# Altium project NMR_System_v2.PrjPcb
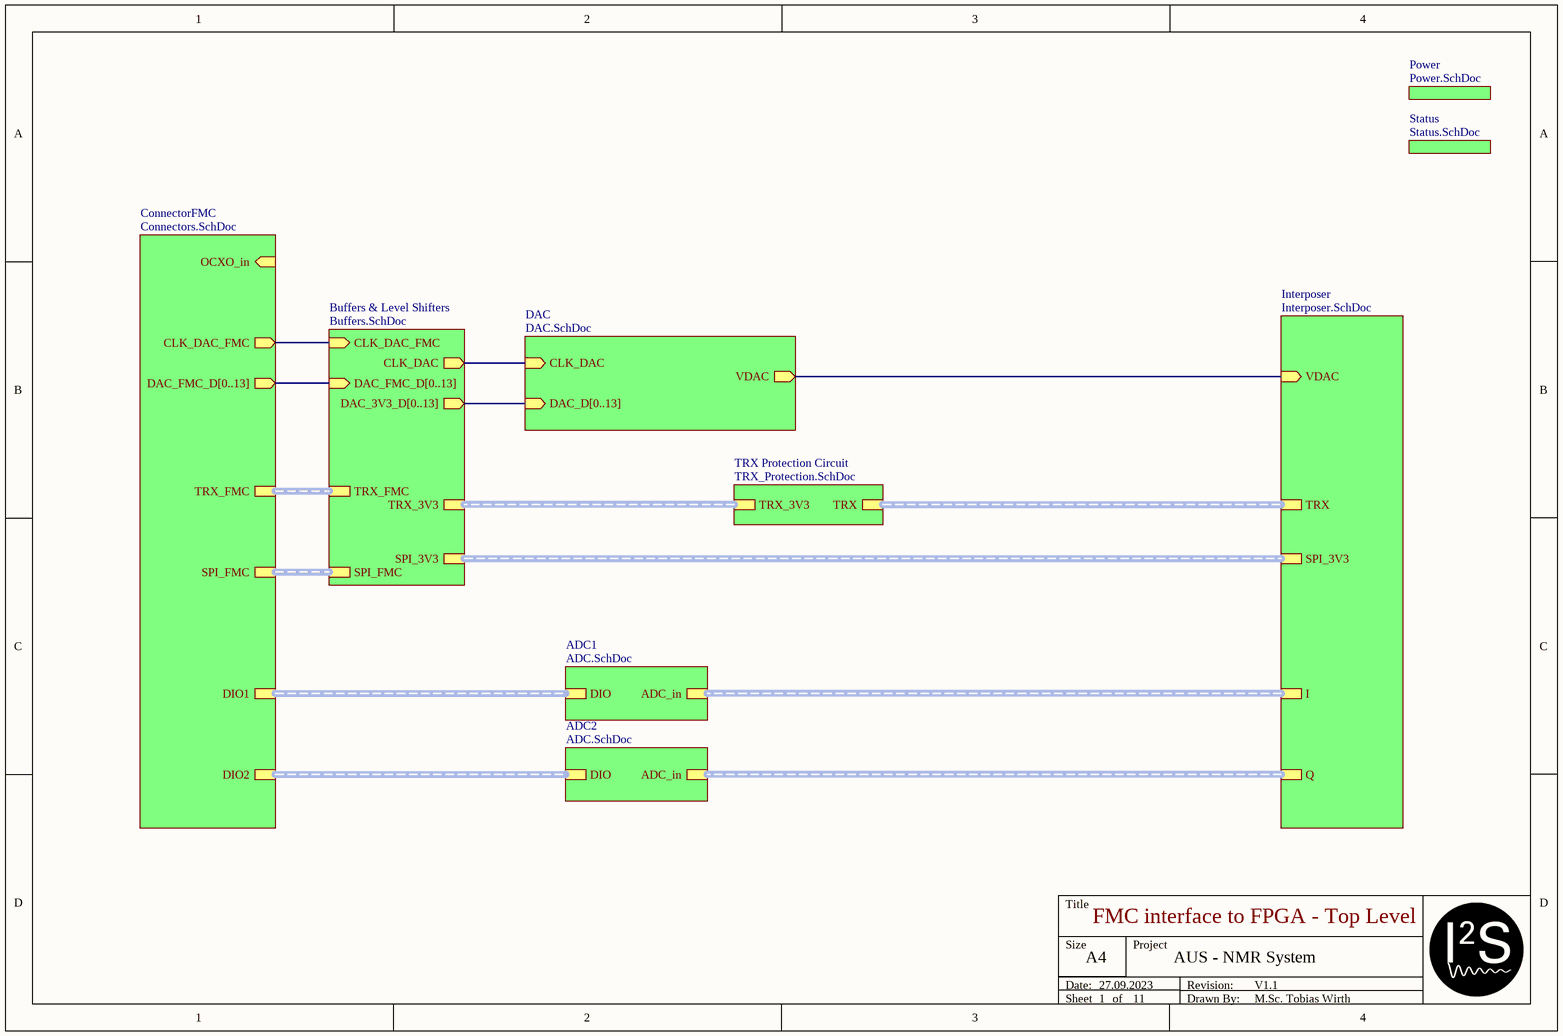
[diagram p0: Top_Level.SchDoc]
CAGE_CODE: ?????; CONTRACT_NUMBER: <CONTRACT NO>; DOC_NO_ASSY_DWG: <ASSY DWG NO>; DOC_NO_BOM: <BOM DOC NO>; DOC_NO_FAB_DWG: <FAB DWG NO>; DOC_NO_SCH_DWG: <SCH DWG NO>; PCB_2_DEC_TOL: +/-.01; PCB_3_DEC_TOL: +/-.010; PCB_ANG_TOL: +/-1/2; PCB_ASSEMBLY_NO: <PCB ASSY NO>; PCB_CHECKER: - -----; PCB_CHECKER_APP_DATE: --/--/----; PCB_DESIGNER: - -----; PCB_DESIGNER_APP_DATE: --/--/----; PCB_DWG_NO: <PCB DWG NO>; PCB_ENGINEER: - -----; PCB_ENGINEER_APP_DATE: --/--/----; PCB_PART_NUMBER: <PCB PN>; PCB_REV: A; SCH_REV: A
9 sheets, 133 parts. Net scope: hierarchical (ports join the sheet entries above them; power ports are global).
Board file: NMR_System_v2.PcbDoc
Sheets:
  Top_Level.SchDoc
    ConnectorFMC = Connectors.SchDoc
    DAC = DAC.SchDoc
    Interposer = Interposer.SchDoc
    ADC2 = ADC.SchDoc
    ADC1 = ADC.SchDoc
    Power = Power.SchDoc
      PDN Backend = Power_BE.SchDoc
    Status = Status.SchDoc
    TRX Protection Circuit = TRX_Protection.SchDoc

## Sheet Top_Level.SchDoc: FMC interface to FPGA - Top Level
size A4; Date: 27.09.2023; ApprovedBy: M.Sc. Tobias Wirth; CheckedBy: M.Sc. Tobias Wirth; Author: M.Sc. Tobias Wirth; CompanyName: University of Stuttgart; DrawnBy: M.Sc. Tobias Wirth; Engineer: M.Sc. Tobias Wirth; Organization: IIS; Address1: Pfaffenwaldring 47; Address2: 70569 Stuttgart; Revision: V1.1; SheetNumber: 1; SheetTotal: 11; ProjectNameAlt: AUS - NMR System; Time: 10:00; ImagePath: N/A; Application_BuildNumber: N/A

### Sub-sheets
ADC1 = ADC.SchDoc: DIO (harness DIO), ADC_in (harness ADC_IN)
ADC2 = ADC.SchDoc: DIO (harness DIO), ADC_in (harness ADC_IN)
Buffers & Level Shifters = Buffers.SchDoc (file not in this document): DAC_FMC_D[0..13] (in), CLK_DAC_FMC (in), TRX_FMC (harness TRX_FMC), SPI_FMC (harness SPI_FMC), CLK_DAC (out), DAC_3V3_D[0..13] (out), TRX_3V3 (harness TRX_3V3), SPI_3V3 (harness SPI_3V3)
ConnectorFMC = Connectors.SchDoc: DIO1 (harness DIO), DIO2 (harness DIO), DAC_FMC_D[0..13] (out), CLK_DAC_FMC (out), OCXO_in (in), TRX_FMC (harness TRX_FMC), SPI_FMC (harness SPI_FMC)
DAC = DAC.SchDoc: VDAC (out), CLK_DAC (in), DAC_D[0..13] (in)
Interposer = Interposer.SchDoc: VDAC (in), TRX (harness TRX), SPI_3V3 (harness SPI_3V3), Q (harness ADC_IN), I (harness ADC_IN)
Power = Power.SchDoc: no entries
Status = Status.SchDoc: no entries
TRX Protection Circuit = TRX_Protection.SchDoc: TRX_3V3 (harness TRX_3V3), TRX (harness TRX)

### Nets
CLK_DAC_FMC: sheet ConnectorFMC/CLK_DAC_FMC, sheet Buffers & Level Shifters/CLK_DAC_FMC
NetR2_2: sheet DAC/VDAC, sheet Interposer/VDAC
NetR4_1: sheet DAC/CLK_DAC, sheet Buffers & Level Shifters/CLK_DAC

### Buses and harness runs
bus sheet Buffers & Level Shifters/DAC_3V3_D[0..13] = sheet DAC/DAC_D[0..13]
bus sheet Buffers & Level Shifters/DAC_FMC_D[0..13] = sheet ConnectorFMC/DAC_FMC_D[0..13]
harness sheet ADC1/ADC_in = sheet Interposer/I
harness sheet ADC1/DIO = sheet ConnectorFMC/DIO1
harness sheet ADC2/ADC_in = sheet Interposer/Q
harness sheet ADC2/DIO = sheet ConnectorFMC/DIO2
harness sheet Buffers & Level Shifters/SPI_3V3 = sheet Interposer/SPI_3V3
harness sheet Buffers & Level Shifters/SPI_FMC = sheet ConnectorFMC/SPI_FMC
harness sheet Buffers & Level Shifters/TRX_3V3 = sheet TRX Protection Circuit/TRX_3V3
harness sheet Buffers & Level Shifters/TRX_FMC = sheet ConnectorFMC/TRX_FMC
harness sheet Interposer/TRX = sheet TRX Protection Circuit/TRX

### Notes on the sheet
- Title
- Size
- Date:
- Sheet
- A4
- of
- Project
- Drawn By:
- Revision:

## Sheet Connectors.SchDoc: Connectors
size A4; Date: 27.09.2023; ApprovedBy: M.Sc. Tobias Wirth; CheckedBy: M.Sc. Tobias Wirth; Author: M.Sc. Tobias Wirth; CompanyName: University of Stuttgart; DrawnBy: M.Sc. Tobias Wirth; Engineer: M.Sc. Tobias Wirth; Organization: IIS; Address1: Pfaffenwaldring 47; Address2: 70569 Stuttgart; Revision: V1.4; SheetNumber: 2; SheetTotal: 17; ProjectNameAlt: AUS - NMR System; Time: 14:10; ImagePath: N/A; Application_BuildNumber: N/A
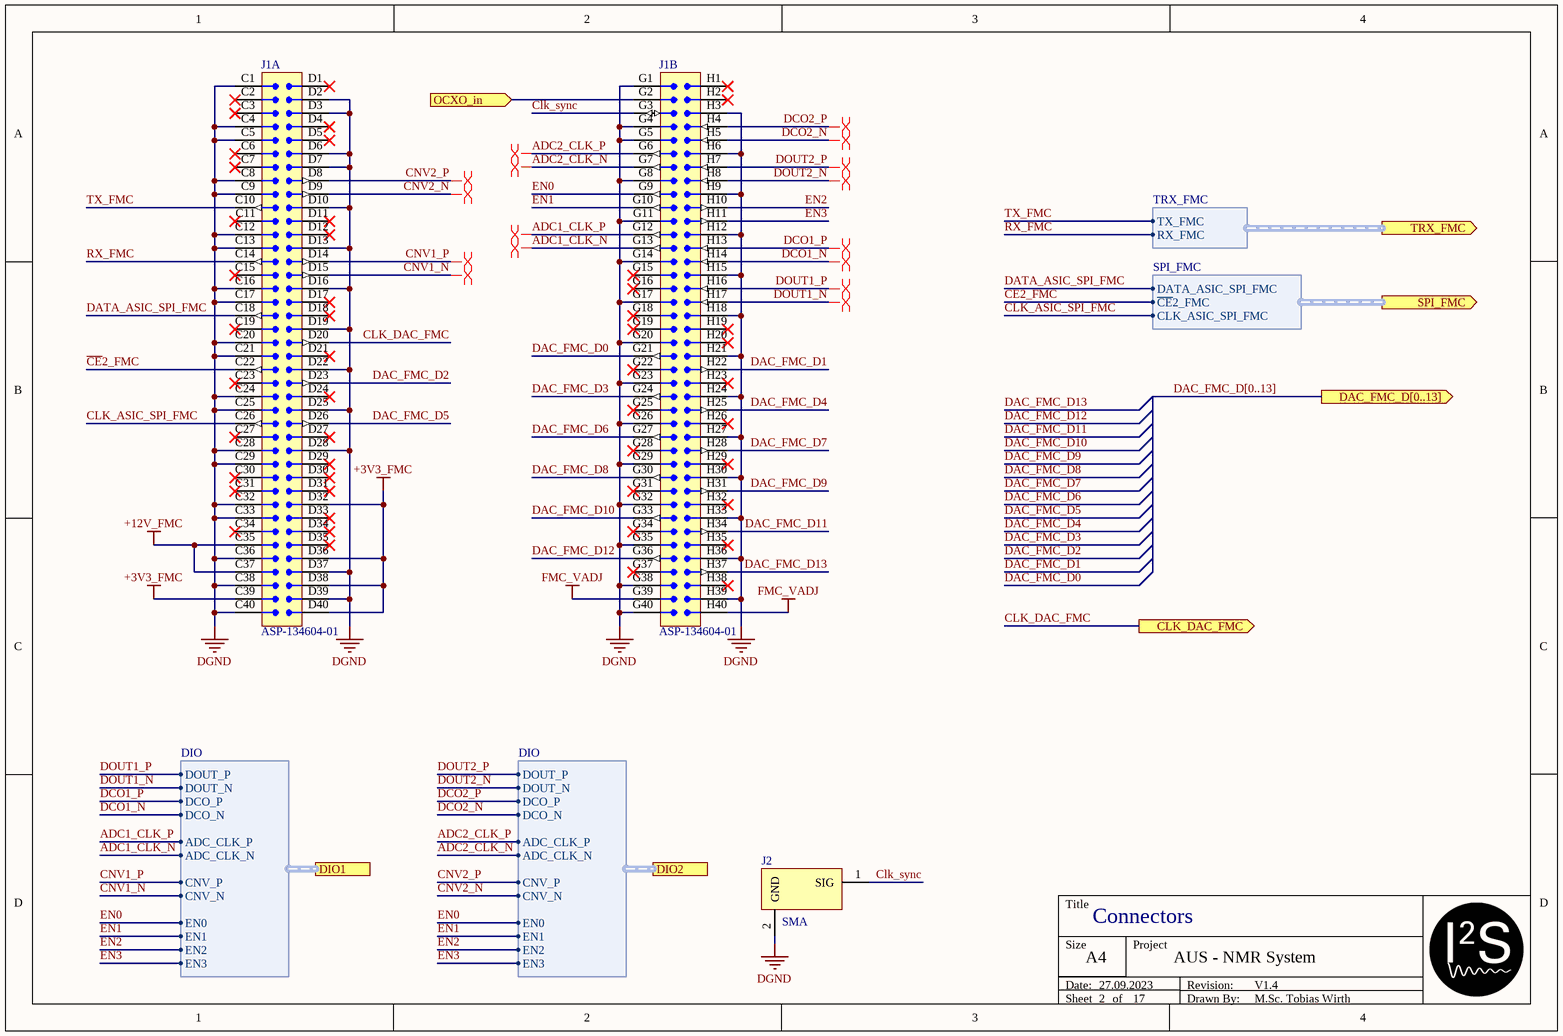
[diagram p1: Connectors.SchDoc]

### Parts
J1  ASP-134604-01  [ASP13460401]  (parts A,B of 2)
J2  SMA  [SMA]

### Ports
CLK_DAC_FMC (out), DAC_FMC_D[0..13] (out), DIO1 (harness DIO), DIO2 (harness DIO), OCXO_in (in), SPI_FMC (out, harness SPI_FMC), TRX_FMC (out, harness TRX_FMC)

### Harnesses
DIO: ADC_CLK_N, ADC_CLK_P, CNV_N, CNV_P, DCO_N, DCO_P, DOUT_N, DOUT_P, EN0, EN1, EN2, EN3
SPI_FMC: DATA_ASIC_SPI_FMC, ~{CE}2_FMC, CLK_ASIC_SPI_FMC
TRX_FMC: TX_FMC, RX_FMC

### Nets
+3V3_FMC: J1.C39 J1.D32 J1.D36 J1.D38 J1.D40
+12V_FMC: J1.C35 J1.C37
DGND: J1.C1 J1.C4 J1.C5 J1.C8 J1.C9 J1.C12 J1.C13 J1.C16 J1.C17 J1.C20 J1.C21 J1.C24 J1.C25 J1.C28 J1.C29 J1.C32 J1.C33 J1.C36 J1.C38 J1.C40 J1.D2 J1.D3 J1.D6 J1.D7 J1.D10 J1.D13 J1.D16 J1.D19 J1.D22 J1.D25 J1.D28 J1.D37 J1.D39 J1.G1 J1.G4 J1.G5 J1.G8 J1.G11 J1.G14 J1.G17 J1.G20 J1.G23 J1.G26 J1.G29 J1.G32 J1.G35 J1.G38 J1.G40 J1.H3 J1.H6 J1.H9 J1.H12 J1.H15 J1.H18 J1.H21 J1.H24 J1.H27 J1.H30 J1.H33 J1.H36 J1.H39 J2.2(GND)
FMC_VADJ: J1.G39 J1.H40
ADC1_CLK_N: J1.G13 ; port DIO1.ADC_CLK_N
ADC1_CLK_P: J1.G12 ; port DIO1.ADC_CLK_P
ADC2_CLK_N: J1.G7 ; port DIO2.ADC_CLK_N
ADC2_CLK_P: J1.G6 ; port DIO2.ADC_CLK_P
~{CE}2_FMC: J1.C22 ; port SPI_FMC.~{CE}2_FMC
CLK_ASIC_SPI_FMC: J1.C26 ; port SPI_FMC.CLK_ASIC_SPI_FMC
CLK_DAC_FMC: J1.D20 ; port CLK_DAC_FMC
Clk_sync: J1.G3 J2.1(SIG)
CNV1_N: J1.D15 ; port DIO1.CNV_N
CNV1_P: J1.D14 ; port DIO1.CNV_P
CNV2_N: J1.D9 ; port DIO2.CNV_N
CNV2_P: J1.D8 ; port DIO2.CNV_P
DAC_FMC_D0: J1.G21
DAC_FMC_D1: J1.H22
DAC_FMC_D2: J1.D23
DAC_FMC_D3: J1.G24
DAC_FMC_D4: J1.H25
DAC_FMC_D5: J1.D26
DAC_FMC_D6: J1.G27
DAC_FMC_D7: J1.H28
DAC_FMC_D8: J1.G30
DAC_FMC_D9: J1.H31
DAC_FMC_D10: J1.G33
DAC_FMC_D11: J1.H34
DAC_FMC_D12: J1.G36
DAC_FMC_D13: J1.H37
DATA_ASIC_SPI_FMC: J1.C18 ; port SPI_FMC.DATA_ASIC_SPI_FMC
DCO1_N: J1.H14 ; port DIO1.DCO_N
DCO1_P: J1.H13 ; port DIO1.DCO_P
DCO2_N: J1.H5 ; port DIO2.DCO_N
DCO2_P: J1.H4 ; port DIO2.DCO_P
DOUT1_N: J1.H17 ; port DIO1.DOUT_N
DOUT1_P: J1.H16 ; port DIO1.DOUT_P
DOUT2_N: J1.H8 ; port DIO2.DOUT_N
DOUT2_P: J1.H7 ; port DIO2.DOUT_P
EN0: J1.G9 ; port DIO1.EN0, port DIO2.EN0
EN1: J1.G10 ; port DIO1.EN1, port DIO2.EN1
EN2: J1.H10 ; port DIO1.EN2, port DIO2.EN2
EN3: J1.H11 ; port DIO1.EN3, port DIO2.EN3
RX_FMC: J1.C14 ; port TRX_FMC.RX_FMC
TX_FMC: J1.C10 ; port TRX_FMC.TX_FMC
NetJ1_G2: J1.G2 ; port OCXO_in

Not connected (* = marked no-connect by the designer): J1 C2* C3* C6* C7* C11* C15* C19* C23* C27* C30* C31* C34* D1* D4* D5* D11* D12* D17* D18* D21* D24* D27* D29* D30* D31* D33* D34* D35* G15* G16* G18* G19* G22* G25* G28* G31* G34* G37* H1* H2* H19* H20* H23* H26* H29* H32* H35* H38*

### Buses and harness runs
bus DAC_FMC_D[0..13] = port DAC_FMC_D[0..13]

### Layout directives
differential pair: ADC1_CLK_N, ADC1_CLK_P, ADC2_CLK_N, ADC2_CLK_P, CNV1_N, CNV1_P, CNV2_N, CNV2_P, DCO1_N, DCO1_P, DCO2_N, DCO2_P, DOUT1_N, DOUT1_P, DOUT2_N, DOUT2_P

### Notes on the sheet
- Title
- Size
- Date:
- Sheet
- A4
- of
- Project
- Drawn By:
- Revision:

### Library data of the parts
J1 = ASP-134604-01: Board to Board & Mezzanine Connectors "ASP"; Supplier 1: Arrow Electronics; Supplier Part Number 1: ASP-134604-01

## Sheet DAC.SchDoc: Digital to Analog Converter
size A4; Date: 27.09.2023; ApprovedBy: M.Sc. Tobias Wirth; CheckedBy: M.Sc. Tobias Wirth; Author: M.Sc. Tobias Wirth; CompanyName: University of Stuttgart; DrawnBy: M.Sc. Tobias Wirth; Engineer: M.Sc. Tobias Wirth; Organization: IIS; Address1: Pfaffenwaldring 47; Address2: 70569 Stuttgart; Revision: V1.5; SheetNumber: 4; SheetTotal: 11; ProjectNameAlt: AUS - NMR System; Time: 15:20; ImagePath: N/A; Application_BuildNumber: N/A
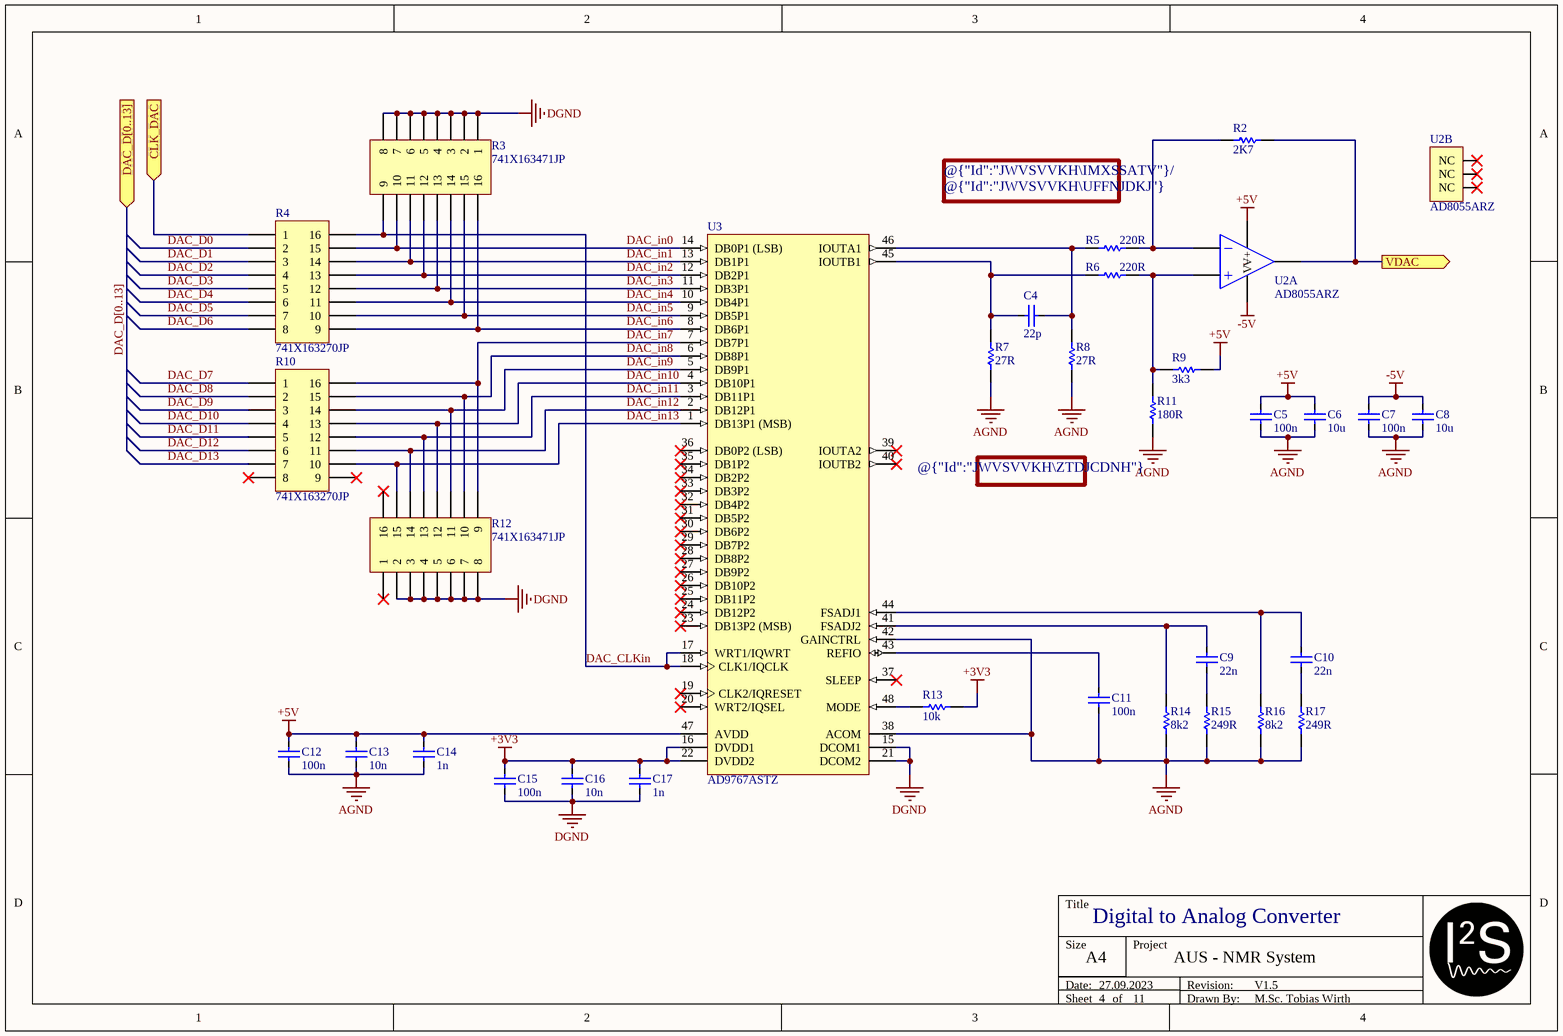
[diagram p2: DAC.SchDoc]

### Parts
C4  22p  [CAP_0402]
C5  100n  [CAP_0402]
C6  10u  [CAP_0603]
C7  100n  [CAP_0402]
C8  10u  [CAP_0603]
C9  22n  [CAP_0402]
C10  22n  [CAP_0402]
C11  100n  [CAP_0402]
C12  100n  [CAP_0402]
C13  10n  [CAP_0402]
C14  1n  [CAP_0402]
C15  100n  [CAP_0402]
C16  10n  [CAP_0402]
C17  1n  [CAP_0402]
R2  2K7  [RES_0402]
R3  741X163471JP  [741X163]
R4  741X163270JP  [741X163]
R5  220R  [RES_0402]
R6  220R  [RES_0402]
R7  27R  [RES_0402]
R8  27R  [RES_0402]
R9  3k3  [RES_0402]
R10  741X163270JP  [741X163]
R11  180R  [RES_0402]
R12  741X163471JP  [741X163]
R13  10k  [RES_0402]
R14  8k2  [RES_0402]
R15  249R  [RES_0402]
R16  8k2  [RES_0402]
R17  249R  [RES_0402]
U2  AD8055ARZ  [SOIC127P600X175-8N]  (parts A,B of 2)
U3  AD9767ASTZ  [TQFP-48_L]

### Ports
CLK_DAC (in), DAC_D[0..13] (in), VDAC (out)

### Nets
+3V3: C15.1 C16.1 C17.1 R13.1 U3.16(DVDD1) U3.22(DVDD2)
+5V: C5.1 C6.1 C12.1 C13.1 C14.1 R9.1 U2.7(V+) U3.47(AVDD)
-5V: C7.1 C8.1 U2.4(V−)
AGND: C5.2 C6.2 C7.2 C8.2 C11.2 C12.2 C13.2 C14.2 R7.1 R8.1 R11.1 R14.1 R15.1 R16.1 R17.1 U3.38(ACOM) U3.42(GAINCTRL)
DGND: C15.2 C16.2 C17.2 R3.1 R3.2 R3.3 R3.4 R3.5 R3.6 R3.7 R3.8 R12.2 R12.3 R12.4 R12.5 R12.6 R12.7 R12.8 U3.15(DCOM1) U3.21(DCOM2)
DAC_CLKin: R3.9 R4.16 U3.17(WRT1/IQWRT) U3.18(CLK1/IQCLK)
DAC_D0: R4.2
DAC_D1: R4.3
DAC_D2: R4.4
DAC_D3: R4.5
DAC_D4: R4.6
DAC_D5: R4.7
DAC_D6: R4.8
DAC_D7: R10.1
DAC_D8: R10.2
DAC_D9: R10.3
DAC_D10: R10.4
DAC_D11: R10.5
DAC_D12: R10.6
DAC_D13: R10.7
DAC_in0: R3.10 R4.15 U3.14(DB0P1_(LSB))
DAC_in1: R3.11 R4.14 U3.13(DB1P1)
DAC_in2: R3.12 R4.13 U3.12(DB2P1)
DAC_in3: R3.13 R4.12 U3.11(DB3P1)
DAC_in4: R3.14 R4.11 U3.10(DB4P1)
DAC_in5: R3.15 R4.10 U3.9(DB5P1)
DAC_in6: R3.16 R4.9 U3.8(DB6P1)
DAC_in7: R10.16 R12.9 U3.7(DB7P1)
DAC_in8: R10.15 R12.10 U3.6(DB8P1)
DAC_in9: R10.14 R12.11 U3.5(DB9P1)
DAC_in10: R10.13 R12.12 U3.4(DB10P1)
DAC_in11: R10.12 R12.13 U3.3(DB11P1)
DAC_in12: R10.11 R12.14 U3.2(DB12P1)
DAC_in13: R10.10 R12.15 U3.1(DB13P1_(MSB))
NetC4_1: C4.1 R5.2 R8.2 U3.46(IOUTA1)
NetC4_2: C4.2 R6.2 R7.2 U3.45(IOUTB1)
NetC9_1: C9.1 R14.2 U3.41(FSADJ2)
NetC9_2: C9.2 R15.2
NetC10_1: C10.1 R16.2 U3.44(FSADJ1)
NetC10_2: C10.2 R17.2
NetC11_1: C11.1 U3.43(REFIO)
NetR2_1: R2.1 R5.1 U2.2(−)
NetR2_2: R2.2 U2.6 ; port VDAC
NetR4_1: R4.1 ; port CLK_DAC
NetR6_1: R6.1 R9.2 R11.2 U2.3(+)
NetR13_2: R13.2 U3.48(MODE)

Not connected (* = marked no-connect by the designer): R10 8* 9*; R12 1* 16*; U2 1(NC)* 5(NC)* 8(NC)*; U3 19(CLK2/IQRESET)* 20(WRT2/IQSEL)* 23(DB13P2_(MSB))* 24(DB12P2)* 25(DB11P2)* 26(DB10P2)* 27(DB9P2)* 28(DB8P2)* 29(DB7P2)* 30(DB6P2)* 31(DB5P2)* 32(DB4P2)* 33(DB3P2)* 34(DB2P2)* 35(DB1P2)* 36(DB0P2_(LSB))* 37(SLEEP)* 39(IOUTA2)* 40(IOUTB2)*

### Buses and harness runs
bus DAC_D[0..13] = port DAC_D[0..13]

### Notes on the sheet
- @{"Id":"JWVSVVKH\IMXSSATV"}/ @{"Id":"JWVSVVKH\UFFNJDKJ"} sets the gain
  @{"Id":"JWVSVVKH\NLDPBRXG"}/ @{"Id":"JWVSVVKH\IJMLKELA"} sets the DC lvl
- @{"Id":"JWVSVVKH\ZTDJCDNH"} ist optional
- Title
- Size
- Date:
- Sheet
- A4
- of
- Project
- Drawn By:
- Revision:

### Library data of the parts
C4-C17 = Cap: Supplier: *; Part Number: *
  C4: Value: 22p
  C5 C7 C11 C12 C15: Value: 100n
  C6 C8: Value: 10u
  C9 C10: Value: 22n
  C13 C16: Value: 10n
  C14 C17: Value: 1n
R2 R5-R9 R11 R13-R17 = Res: Part Number: *; Supplier: *
  R2: Value: 2K7
  R5 R6: Value: 220R
  R7 R8: Value: 27R
  R9: Value: 3k3
  R11: Value: 180R
  R13: Value: 10k
  R14 R16: Value: 8k2
  R15 R17: Value: 249R
R3 R4 R10 R12 = 741X163: Isolated 8 Resistor Network/Array, Convex, Long Side Terminals; Supplier 1: Mouser
  R3 R12: Supplier Part Number 1: 774-741X163471JP
  R4 R10: Supplier Part Number 1: 774-741X163270JP
U2 = AD8055: 300 MHz Voltage Feedback Amplifier; Supplier 1: Mouser; Supplier Part Number 1: 584-AD8055ARZ
U3 = AD9767: Dual 14-Bit TxDAC+, 125 Msps, -40 to +85 degC, ST-48, Pb-Free, Tray; Manufacturer: Analog Devices; Single Supply: Yes; Resolution (Bits): 14; Settling Time: 35ns; Max V+: 5.5V; Op Pwr Diss: 450mW; # DAC Outputs: 2; ComponentLink2Description: Datasheet; ComponentLink2URL: http://www.analog.com/static/imported-files/data_sheets/AD9763_9765_9767.pdf; ComponentLink4URL: http://www.analog.com/en/digital-to-analog-converters/da-converters/ad9767/products/product.html; ComponentLink4Description: Product URL; Packing: Tray; DatasheetVersion: Rev.G; PackageReference: ST-48; RoHS: Y; Generic Part Number: AD9767; ComponentLink3URL: http://www.analog.com/static/imported-files/packages/PKG_PDF/LQFP%28ST%29/ST_48.pdf; ComponentLink1URL: http://www.analog.com/en/index.html; RevisionNote: Component URL fixed; PartNumber: AD9767ASTZ; Mounting Technology: Surface Mount; PackageVersion: revA; ComponentLink1Description: Manufacturer URL; PackageDescription: 48-Pin Thin Quad Flat Pack 0.5 mm Pitch; ComponentLink3Description: Package Specification; Supplier 1: Digi-Key; Supplier Part Number 1: 505-AD9767ASTZ-ND

## Sheet Interposer.SchDoc: Connectors - Frontend
size A4; Date: 28.09.2023; ApprovedBy: M.Sc. Tobias Wirth; CheckedBy: M.Sc. Tobias Wirth; Author: M.Sc. Tobias Wirth; CompanyName: University of Stuttgart; DrawnBy: M.Sc. Tobias Wirth; Engineer: M.Sc. Tobias Wirth; Organization: IIS; Address1: Pfaffenwaldring 47; Address2: 70569 Stuttgart; Revision: V1.2; SheetNumber: 5; SheetTotal: 11; ProjectNameAlt: AUS - NMR System; Time: 13:40; ImagePath: N/A; Application_BuildNumber: N/A
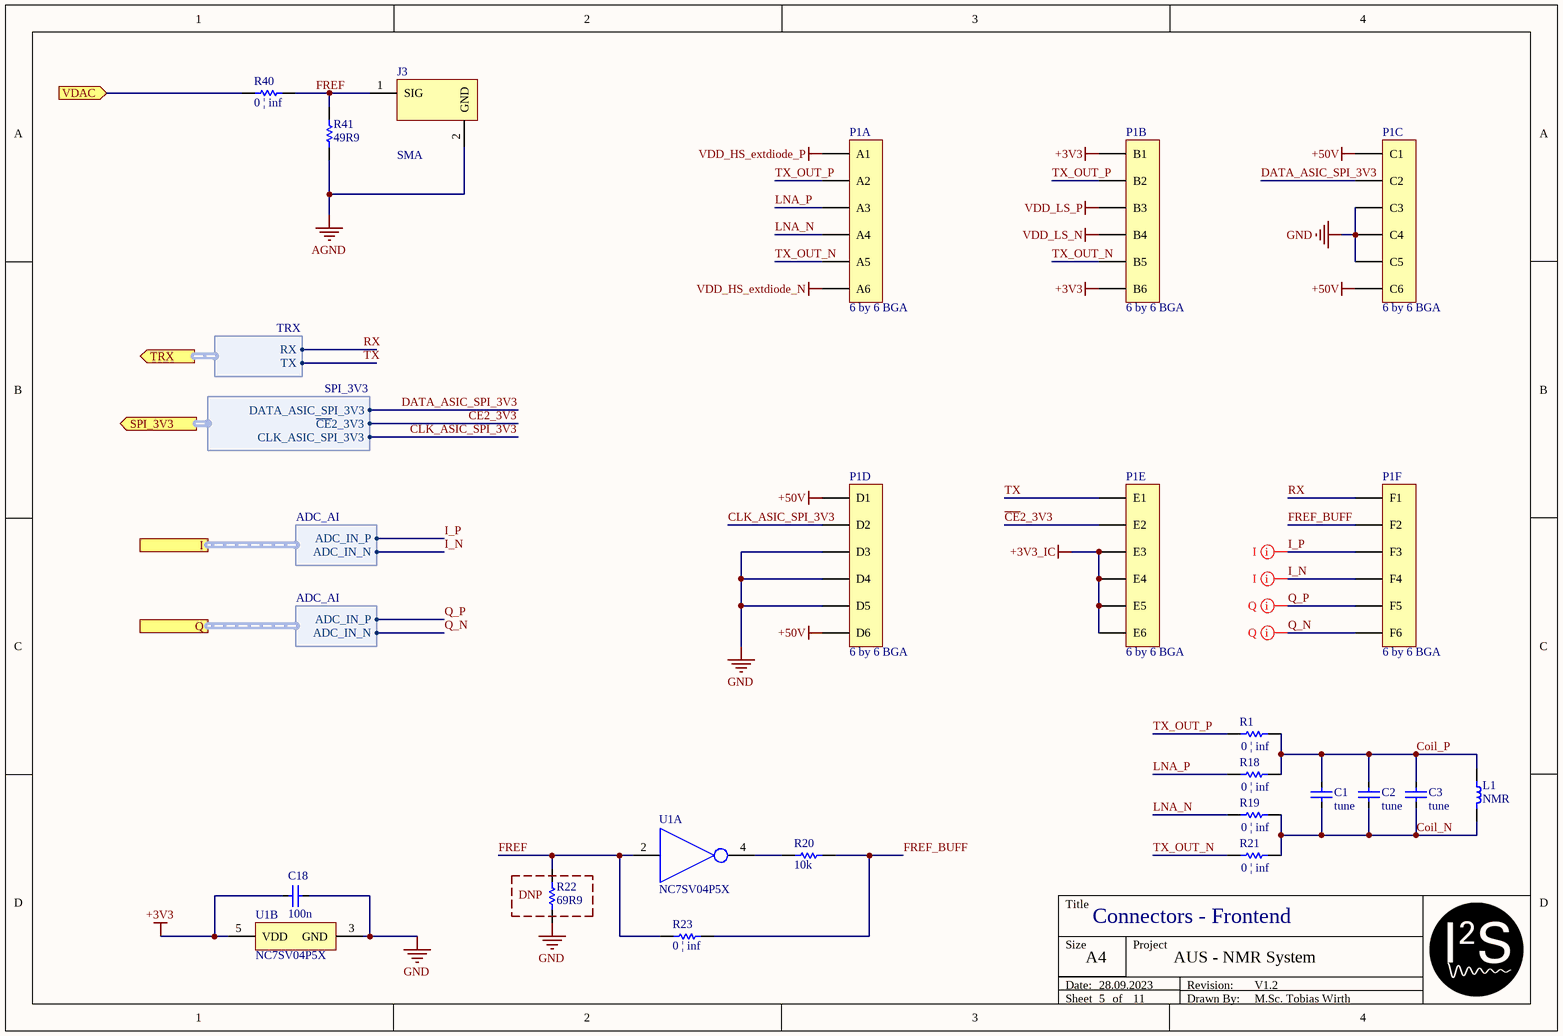
[diagram p3: Interposer.SchDoc]

### Parts
C1  tune  [CAP_1206]
C2  tune  [CAP_0805]
C3  tune  [CAP_0603]
C18  100n  [CAP_0402]
J3  SMA  [SMA]
L1  NMR  [NMR-Coil-Pads]
P1  6 by 6 BGA  [BGA36C230P6X6_1500X1500X190 - Interposer]  (parts A,B,C,D,E,F of 6)
R1  0 | inf  [RES_0402]
R18  0 | inf  [RES_0402]
R19  0 | inf  [RES_0402]
R20  10k  [RES_0402]
R21  0 | inf  [RES_0402]
R22  69R9  [RES_0603]
R23  value 0 | inf  [RES_0402]
R40  0 | inf  [RES_0402]
R41  49R9  [RES_0402]
U1  NC7SV04P5X  [SOT23-65P210X110-5N]  (parts A,B of 2)

### Blocks framed on the sheet
DNP: R22

### Ports
I (harness ADC_AI), Q (harness ADC_AI), SPI_3V3 (out, harness SPI_3V3), TRX (out, harness TRX), VDAC (in)

### Harnesses
TRX: TX, RX
SPI_3V3: DATA_ASIC_SPI_3V3, ~{CE}2_3V3, CLK_ASIC_SPI_3V3
ADC_AI: ADC_IN_P, ADC_IN_N

### Nets
+3V3: C18.1 P1.B1 P1.B6 U1.5(VDD)
+3V3_IC: P1.E3 P1.E4 P1.E5 P1.E6
+50V: P1.C1 P1.C6 P1.D1 P1.D6
AGND: J3.2(GND) R41.1
GND: C18.2 P1.C3 P1.C4 P1.C5 P1.D3 P1.D4 P1.D5 R22.1 U1.3(GND)
VDD_HS_extdiode_N: P1.A6
VDD_HS_extdiode_P: P1.A1
VDD_LS_N: P1.B4
VDD_LS_P: P1.B3
~{CE}2_3V3: P1.E2 ; port SPI_3V3.~{CE}2_3V3
CLK_ASIC_SPI_3V3: P1.D2 ; port SPI_3V3.CLK_ASIC_SPI_3V3
Coil_N: C1.2 C2.2 C3.2 L1.2 R19.1 R21.1
Coil_P: C1.1 C2.1 C3.1 L1.1 R1.1 R18.1
DATA_ASIC_SPI_3V3: P1.C2 ; port SPI_3V3.DATA_ASIC_SPI_3V3
FREF: J3.1(SIG) R22.2 R23.2 R40.2 R41.2 U1.2
FREF_BUFF: P1.F2 R20.2 R23.1
I_N: P1.F4 ; port I.ADC_IN_N  [project net ADC_IN_N]
I_P: P1.F3 ; port I.ADC_IN_P  [project net ADC_IN_P]
LNA_N: P1.A4 R19.2
LNA_P: P1.A3 R18.2
Q_N: P1.F6 ; port Q.ADC_IN_N  [project net ADC_IN_N]
Q_P: P1.F5 ; port Q.ADC_IN_P  [project net ADC_IN_P]
RX: P1.F1 ; port TRX.RX
TX: P1.E1 ; port TRX.TX
TX_OUT_N: P1.A5 P1.B5 R21.2
TX_OUT_P: P1.A2 P1.B2 R1.2
NetR2_2: R40.1 ; port VDAC
NetR20_1: R20.1 U1.4

### Layout directives
differential pair; differential pair class IQ; net class IQ: ADC_IN_N, ADC_IN_P

### Notes on the sheet
- Title
- Size
- Date:
- Sheet
- A4
- of
- Project
- Drawn By:
- Revision:

### Library data of the parts
C1-C3 C18 = Cap: Supplier: *; Part Number: *
  C1-C3: Value: tune
  C18: Value: 100n
L1 = Ind: Part Number: *; Supplier: *; Value: NMR
P1 = BGA_6x6
R1 R18-R23 R40 R41 = Res: Part Number: *; Supplier: *
  R1 R18 R19 R21 R40: Value: 0 | inf
  R20: Value: 10k
  R22: Value: 69R9
  R41: Value: 49R9

## Sheet ADC.SchDoc: Analog to Digital Converter
size A4; Date: 06.10.2023; ApprovedBy: M.Sc. Tobias Wirth; CheckedBy: M.Sc. Tobias Wirth; Author: M.Sc. Tobias Wirth; CompanyName: University of Stuttgart; DrawnBy: M.Sc. Tobias Wirth; Engineer: M.Sc. Tobias Wirth; Organization: IIS; Address1: Pfaffenwaldring 47; Address2: 70569 Stuttgart; Revision: V1.1; SheetNumber: 6; SheetTotal: 11; ProjectNameAlt: AUS - NMR System; Time: 16:00; ImagePath: N/A; Application_BuildNumber: N/A
Used 2 times, as channels ADC2, ADC1. Parts and nets are listed once, with the designators drawn on the sheet.
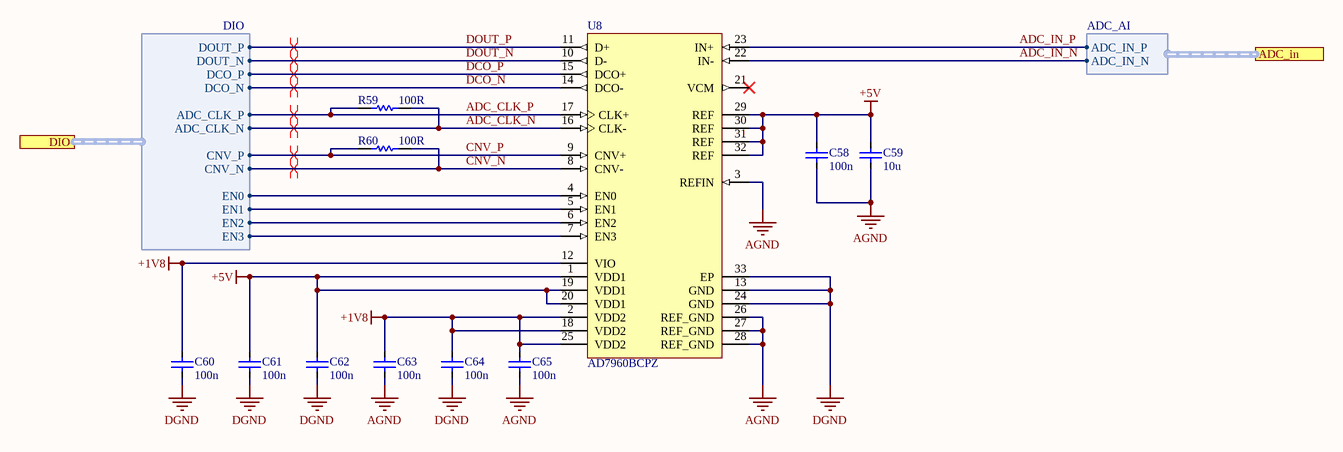
[diagram p4: ADC.SchDoc]

### Parts
C58  100n  [CAP_0402]
C59  10u  [CAP_0603]
C60  100n  [CAP_0402]
C61  100n  [CAP_0402]
C62  100n  [CAP_0402]
C63  100n  [CAP_0402]
C64  100n  [CAP_0402]
C65  100n  [CAP_0402]
R59  100R  [RES_0402]
R60  100R  [RES_0402]
U8  AD7960BCPZ  [ADI-CP-32-7_M]

### Ports
ADC_in (harness ADC_AI), DIO (harness DIO)

### Harnesses
DIO: ADC_CLK_N, ADC_CLK_P, CNV_N, CNV_P, DCO_N, DCO_P, DOUT_N, DOUT_P, EN0, EN1, EN2, EN3
ADC_AI: ADC_IN_P, ADC_IN_N

### Nets
+1V8: C60.1 C63.1 C64.1 C65.1 U8.2(VDD2) U8.12(VIO) U8.18(VDD2) U8.25(VDD2)
+5V: C58.1 C59.1 C61.1 C62.1 U8.1(VDD1) U8.19(VDD1) U8.20(VDD1) U8.29(REF) U8.30(REF) U8.31(REF) U8.32(REF)
AGND: C58.2 C59.2 C63.2 C65.2 U8.3(REFIN) U8.26(REF_GND) U8.27(REF_GND) U8.28(REF_GND)
DGND: C60.2 C61.2 C62.2 C64.2 U8.13(GND) U8.24(GND) U8.33(EP)
ADC_CLK_N: R59.2 U8.16(CLK-) ; port DIO.ADC_CLK_N
ADC_CLK_P: R59.1 U8.17(CLK+) ; port DIO.ADC_CLK_P
ADC_IN_N: U8.22(IN-) ; port ADC_in.ADC_IN_N
ADC_IN_P: U8.23(IN+) ; port ADC_in.ADC_IN_P
CNV_N: R60.2 U8.8(CNV-) ; port DIO.CNV_N
CNV_P: R60.1 U8.9(CNV+) ; port DIO.CNV_P
DCO_N: U8.14(DCO-) ; port DIO.DCO_N
DCO_P: U8.15(DCO+) ; port DIO.DCO_P
DOUT_N: U8.10(D-) ; port DIO.DOUT_N
DOUT_P: U8.11(D+) ; port DIO.DOUT_P
NetU8_4: U8.4(EN0) ; port DIO.EN0
NetU8_5: U8.5(EN1) ; port DIO.EN1
NetU8_6: U8.6(EN2) ; port DIO.EN2
NetU8_7: U8.7(EN3) ; port DIO.EN3

Not connected (* = marked no-connect by the designer): U8 21(VCM)*

### Channels
ADC2: designators end in _ADC2
ADC1: designators end in _ADC1

### Layout directives
differential pair; net class ADC_OUT: ADC2_CLK_N, ADC2_CLK_P, CNV2_N, CNV2_P, DCO2_N, DCO2_P, DOUT2_N, DOUT2_P

### Notes on the sheet
- Title
- Size
- Date:
- Sheet
- A4
- of
- Project
- Drawn By:
- Revision:

### Library data of the parts
C58-C65 = Cap: Supplier: *; Part Number: *
  C58 C60-C65: Value: 100n
  C59: Value: 10u
R59 R60 = Res: Part Number: *; Supplier: *; Value: 100R
U8 = AD7960: Single 18-Bit PulSAR Differential Analog-to-Digital Converter with Serial LVDS Interface, 5 MSPS, -40 to 85 degC, CP-32-7, RoHS, Tray; Manufacturer: Analog Devices; Full Power BW: 28 MHz; # of Channels: 1; Throughput Rate: 5 MSPS; Dynamic Range: 100 dB; Resolution: 18 Bits; ComponentLink1Description: Manufacturer URL; ComponentLink3Description: Package Specification; PartNumber: AD7960BCPZ; ComponentLink1URL: http://www.analog.com/en/index.html; ComponentLink2URL: http://www.analog.com/static/imported-files/data_sheets/AD7960.pdf; ComponentLink3URL: http://www.analog.com/static/imported-files/packages/CP_32_7.pdf; RoHS: TRUE; DatasheetVersion: Rev. A; ADC_Sample_Rate: 5 MSPS; Mounting Technology: Surface Mount; Packing: Tray; PackageReference: CP-32-7; Temperature Range: -40 to 85 degC; ComponentLink2Description: Datasheet; PackageDescription: 32-Pin Lead Frame Chip Scale Package, Body 5 x 5 mm, Pitch 0.5 mm; PackageVersion: 112408-A; Supplier 1: Mouser; Supplier Part Number 1: 584-AD7960BCPZ

## Sheet Power.SchDoc: Power Delivery Network
size A4; Date: 01.11.2023; ApprovedBy: M.Sc. Tobias Wirth; CheckedBy: M.Sc. Tobias Wirth; Author: M.Sc. Tobias Wirth; CompanyName: University of Stuttgart; DrawnBy: M.Sc. Tobias Wirth; Engineer: M.Sc. Tobias Wirth; Organization: IIS; Address1: Pfaffenwaldring 47; Address2: 70569 Stuttgart; Revision: V0.1; SheetNumber: 15; SheetTotal: 17; ProjectNameAlt: AUS - NMR System; Time: 11:00; ImagePath: N/A; Application_BuildNumber: N/A
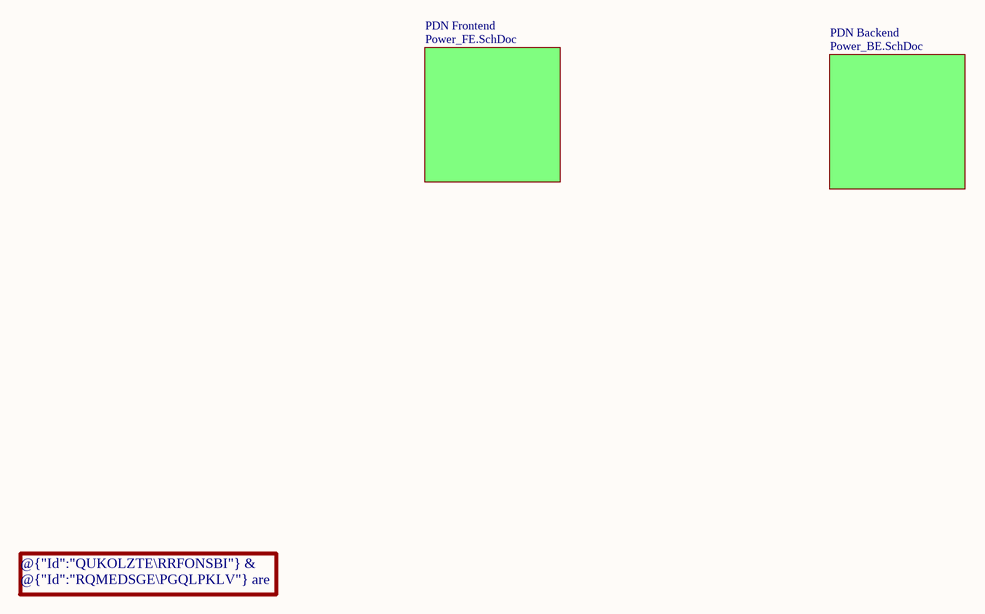
[diagram p5: Power.SchDoc]

### Sub-sheets
PDN Backend = Power_BE.SchDoc: no entries
PDN Frontend = Power_FE.SchDoc (file not in this document): no entries

### Notes on the sheet
- @{"Id":"QUKOLZTE\RRFONSBI"} & @{"Id":"RQMEDSGE\PGQLPKLV"} are end of life products, for future revisions switch to TPS7A26
- Title
- Size
- Date:
- Sheet
- A4
- of
- Project
- Drawn By:
- Revision:

## Sheet Power_BE.SchDoc: PDN - Backend
size A4; Date: 06.10.2023; ApprovedBy: M.Sc. Tobias Wirth; CheckedBy: M.Sc. Tobias Wirth; Author: M.Sc. Tobias Wirth; CompanyName: University of Stuttgart; DrawnBy: M.Sc. Tobias Wirth; Engineer: M.Sc. Tobias Wirth; Organization: IIS; Address1: Pfaffenwaldring 47; Address2: 70569 Stuttgart; Revision: V1.2; SheetNumber: 16; SheetTotal: 17; ProjectNameAlt: AUS - NMR System; Time: 17:30; ImagePath: N/A; Application_BuildNumber: N/A
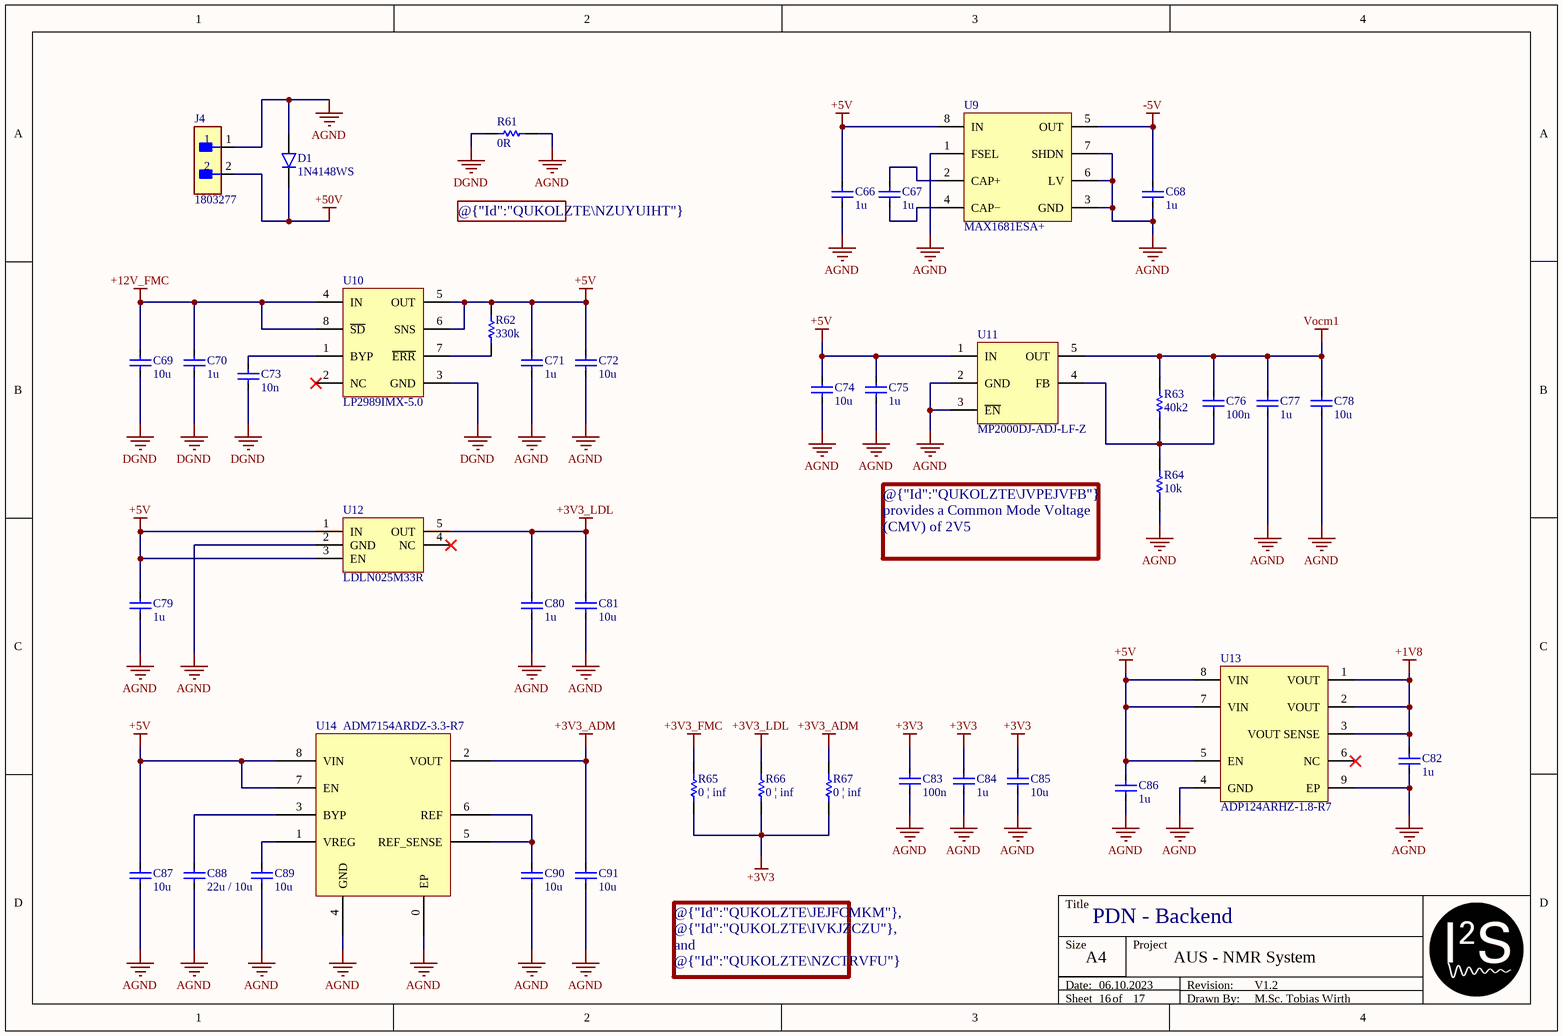
[diagram p6: Power_BE.SchDoc]

### Parts
C66  1u  [CAP_0402]
C67  1u  [CAP_0402]
C68  1u  [CAP_0402]
C69  10u  [CAP_0603]
C70  1u  [CAP_0402]
C71  1u  [CAP_0402]
C72  10u  [CAP_0603]
C73  10n  [CAP_0402]
C74  10u  [CAP_0603]
C75  1u  [CAP_0402]
C76  100n  [CAP_0402]
C77  1u  [CAP_0402]
C78  10u  [CAP_0603]
C79  1u  [CAP_0402]
C80  1u  [CAP_0402]
C81  10u  [CAP_0603]
C82  1u  [CAP_0402]
C83  100n  [CAP_0402]
C84  1u  [CAP_0402]
C85  10u  [CAP_0603]
C86  1u  [CAP_0402]
C87  10u  [CAP_0603]
C88  22u / 10u  [CAP_0603]
C89  10u  [CAP_0603]
C90  10u  [CAP_0603]
C91  10u  [CAP_0603]
D1  1N4148WS  [SOD-123F]
J4  1803277  [Phoenix_MC1,5/2-G-3,81]
R61  0R  [RES_0402]
R62  330k  [RES_0402]
R63  40k2  [RES_0402]
R64  10k  [RES_0402]
R65  0 | inf  [RES_0402]
R66  0 | inf  [RES_0402]
R67  0 | inf  [RES_0402]
U9  MAX1681ESA+  [SOP127P600X175-8N]
U10  LP2989IMX-5.0  [SOP127P600X175-8N]
U11  MP2000DJ-ADJ-LF-Z  [SOT95P280X145-5N]
U12  LDLN025M33R  [SOT95P280X145-5N]
U13  ADP124ARHZ-1.8-R7  [TSOP65P490X94_HS-9N - TW]
U14  ADM7154ARDZ-3.3-R7  [SOIC-8_TP - TW]

### Nets
+1V8: C82.1 U13.1(VOUT) U13.2(VOUT) U13.3(VOUT_SENSE)
+3V3: C83.1 C84.1 C85.1 R65.1 R66.1 R67.1
+3V3_ADM: C91.1 R67.2 U14.2(VOUT)
+3V3_FMC: R65.2
+3V3_LDL: C80.1 C81.1 R66.2 U12.5(OUT)
+5V: C66.1 C71.1 C72.1 C74.1 C75.1 C79.1 C86.1 C87.1 R62.2 U9.8(IN) U10.5(OUT) U10.6(SNS) U11.1(IN) U12.1(IN) U12.3(EN) U13.5(EN) U13.7(VIN) U13.8(VIN) U14.7(EN) U14.8(VIN)
+12V_FMC: C69.1 C70.1 U10.4(IN) U10.8(~{SD})
+50V: D1.2 J4.2
-5V: C68.1 U9.5(OUT)
AGND: C66.2 C68.2 C71.2 C72.2 C74.2 C75.2 C77.2 C78.2 C79.2 C80.2 C81.2 C82.2 C83.2 C84.2 C85.2 C86.2 C87.2 C88.2 C89.2 C90.2 C91.2 D1.1 J4.1 R61.2 R64.1 U9.1(FSEL) U9.3(GND) U9.6(LV) U9.7(SHDN) U11.2(GND) U11.3(~{EN}) U12.2(GND) U13.4(GND) U13.9(EP) U14.0(EP) U14.4(GND)
DGND: C69.2 C70.2 C73.2 R61.1 U10.3(GND)
Vocm1: C76.1 C77.1 C78.1 R63.2 U11.5(OUT)
NetC67_1: C67.1 U9.2(CAP+)
NetC67_2: C67.2 U9.4(CAP−)
NetC73_1: C73.1 U10.1(BYP)
NetC76_2: C76.2 R63.1 R64.2 U11.4(FB)
NetC88_1: C88.1 U14.3(BYP)
NetC89_1: C89.1 U14.1(VREG)
NetC90_1: C90.1 U14.5(REF_SENSE) U14.6(REF)
NetR62_1: R62.1 U10.7(~{ERR})

Not connected (* = marked no-connect by the designer): U10 2(NC)*; U12 4(NC)*; U13 6(NC)*

### Notes on the sheet
- @{"Id":"QUKOLZTE\NZUYUIHT"} is a net tie
- @{"Id":"QUKOLZTE\JVPEJVFB"} provides a Common Mode Voltage (CMV) of 2V5
  Vout = 0.5V x (1 + @{"Id":"QUKOLZTE\JVPEJVFB"} / @{"Id":"QUKOLZTE\AKRNTEXK"} )
- @{"Id":"QUKOLZTE\JEJFCMKM"}, @{"Id":"QUKOLZTE\IVKJZCZU"}, and @{"Id":"QUKOLZTE\NZCTRVFU"} are used to control the +3V3 VDD of the DAC and TRX protection circuit
- Title
- Size
- Date:
- Sheet
- A4
- of
- Project
- Drawn By:
- Revision:

### Library data of the parts
C66-C91 = Cap: Supplier: *; Part Number: *
  C66-C68 C70 C71 C75 C77 C79 C80 C82 C84 C86: Value: 1u
  C69 C72 C74 C78 C81 C85 C87 C89-C91: Value: 10u
  C73: Value: 10n
  C76 C83: Value: 100n
  C88: Value: 22u / 10u
D1 = Diode: Supplier 1: Future Electronics; Supplier Part Number 1: 8814485
J4 = Phoenix_MC1,5/2-G-3,81: Manufacturer: Phoenix Contact; Manufacturer P/N: 1803277; Manufacturer Name: MC 1,5/ 2-G-3,81; Supplier 1: Arrow Electronics; Supplier Part Number 1: 1803277
R61 = Res: Net tie; Part Number: *; Supplier: *; Value: 0R
R62-R67 = Res: Part Number: *; Supplier: *
  R62: Value: 330k
  R63: Value: 40k2
  R64: Value: 10k
  R65-R67: Value: 0 | inf
U9 = MAX1681: 125mA, Frequency-Selectable, Switched-Capacitor Voltage Converters; Supplier 1: Mouser; Supplier Part Number 1: 700-MAX1681ESA
U10 = LP2989: Supplier 1: Heisener; Supplier Part Number 1: LP2989IMX-5.0
U11 = MP2000: Supplier 1: Digi-Key; Supplier Part Number 1: 1589-1865-1-ND
U12 = LDLN025: Supplier 1: Mouser; Supplier Part Number 1: 511-LDLN025M33R
U13 = ADP124: Supplier 1: Mouser; Supplier Part Number 1: 584-ADP124ARHZ-1.8R7
U14 = ADM715X: Supplier 1: Mouser; Supplier Part Number 1: 584-ADM7154ARDZ3.3R7

## Sheet Status.SchDoc: Status LEDs / Test Points
size A4; Date: 06.10.2023; ApprovedBy: M.Sc. Tobias Wirth; CheckedBy: M.Sc. Tobias Wirth; Author: M.Sc. Tobias Wirth; CompanyName: University of Stuttgart; DrawnBy: M.Sc. Tobias Wirth; Engineer: M.Sc. Tobias Wirth; Organization: IIS; Address1: Pfaffenwaldring 47; Address2: 70569 Stuttgart; Revision: V1.2; SheetNumber: 13; SheetTotal: 17; ProjectNameAlt: AUS - NMR System; Time: 21:30; ImagePath: N/A; Application_BuildNumber: N/A
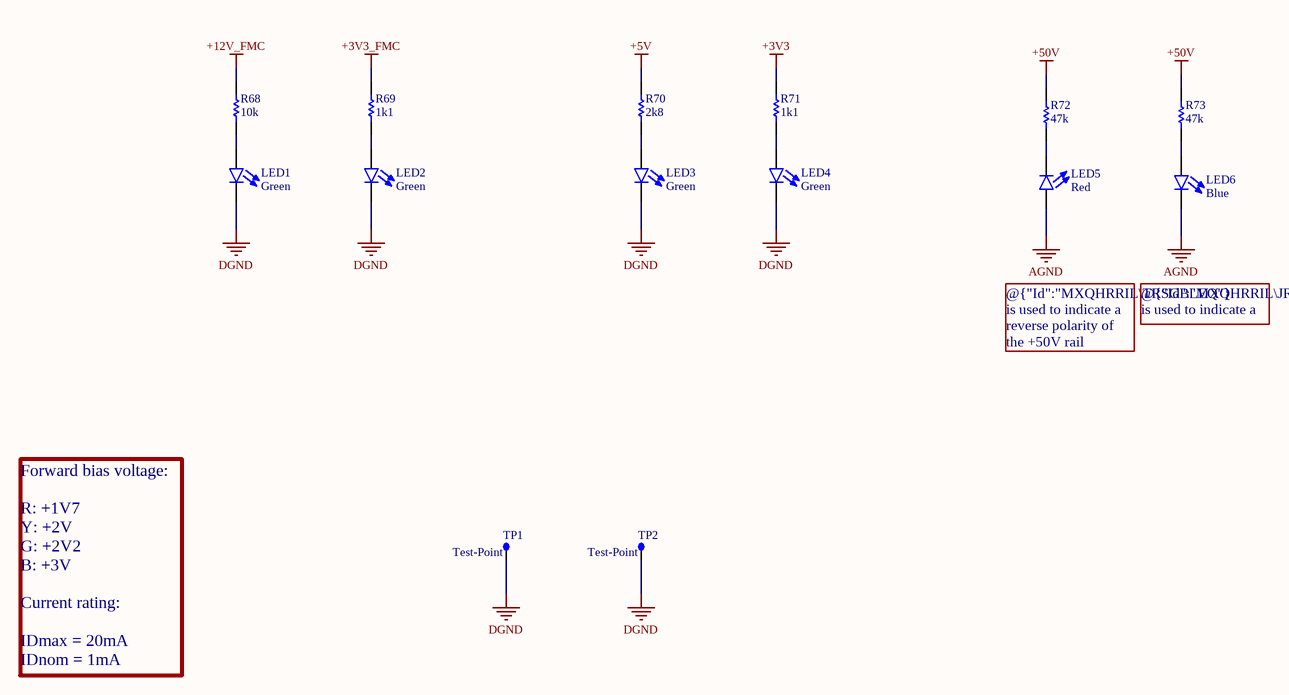
[diagram p7: Status.SchDoc]

### Parts
LED1  Green  [RES_0603]
LED2  Green  [RES_0603]
LED3  Green  [RES_0603]
LED4  Green  [RES_0603]
LED5  Red  [RES_0603]
LED6  Blue  [RES_0603]
R68  10k  [RES_0402]
R69  1k1  [RES_0402]
R70  2k8  [RES_0402]
R71  1k1  [RES_0402]
R72  47k  [RES_0402]
R73  47k  [RES_0402]
TP1  Test-Point  [Test-Point-2]
TP2  Test-Point  [Test-Point-2]

### Nets
+3V3: R71.2
+3V3_FMC: R69.2
+5V: R70.2
+12V_FMC: R68.2
+50V: R72.2 R73.2
AGND: LED5.1 LED6.2
DGND: LED1.2 LED2.2 LED3.2 LED4.2 TP1.1(TP) TP2.1(TP)
NetLED1_1: LED1.1 R68.1
NetLED2_1: LED2.1 R69.1
NetLED3_1: LED3.1 R70.1
NetLED4_1: LED4.1 R71.1
NetLED5_2: LED5.2 R72.1
NetLED6_1: LED6.1 R73.1

### Notes on the sheet
- @{"Id":"MXQHRRIL\TRSGBLEQ"} is used to indicate a reverse polarity of the +50V rail
- @{"Id":"MXQHRRIL\JRXIIWLO"} is used to indicate a live +50V
- Forward bias voltage:
  R: +1V7
  Y: +2V
  G: +2V2
  B: +3V
  Current rating:
  IDmax = 20mA
  IDnom = 1mA
- Title
- Size
- Date:
- Sheet
- A4
- of
- Project
- Drawn By:
- Revision:

### Library data of the parts
LED1-LED6 = LED
R68-R73 = Res: Part Number: *; Supplier: *
  R68: Value: 10k
  R69 R71: Value: 1k1
  R70: Value: 2k8
  R72 R73: Value: 47k
TP1 TP2 = Test-Point: Generic Test Point; Supplier 1: Digi-Key; Supplier Part Number 1: 36-5016CT-ND

## Sheet TRX_Protection.SchDoc: TRX Protection Circuit
size A4; Date: 07.10.2023; ApprovedBy: M.Sc. Tobias Wirth; CheckedBy: M.Sc. Tobias Wirth; Author: M.Sc. Tobias Wirth; CompanyName: University of Stuttgart; DrawnBy: M.Sc. Tobias Wirth; Engineer: M.Sc. Tobias Wirth; Organization: IIS; Address1: Pfaffenwaldring 47; Address2: 70569 Stuttgart; Revision: V1.1; SheetNumber: 14; SheetTotal: 17; ProjectNameAlt: AUS - NMR System; Time: 10:00; ImagePath: N/A; Application_BuildNumber: N/A
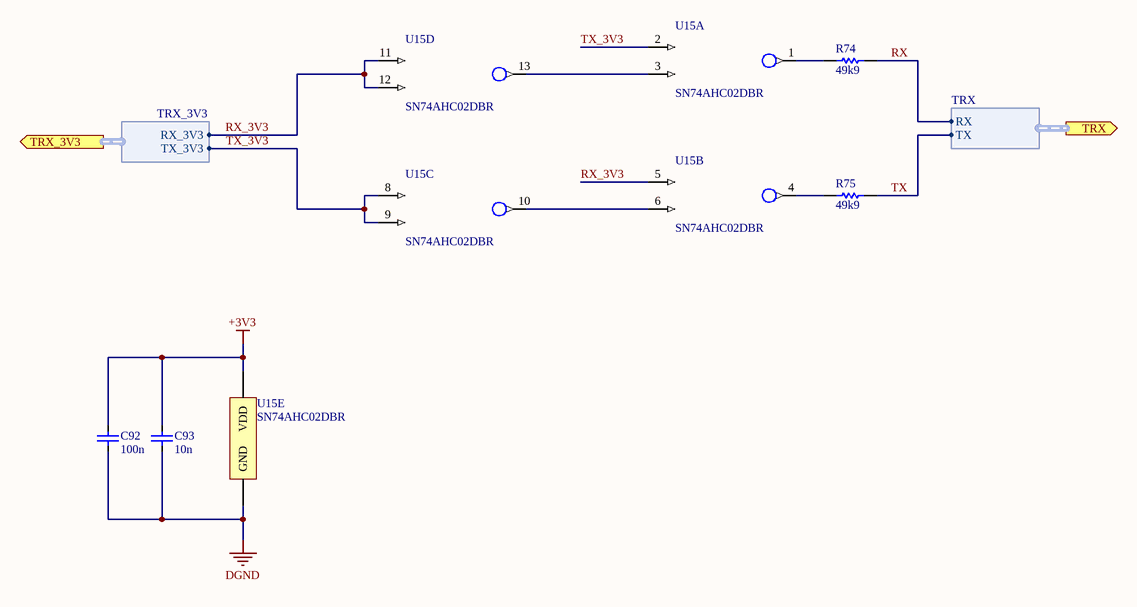
[diagram p8: TRX_Protection.SchDoc]

### Parts
C92  100n  [CAP_0402]
C93  10n  [CAP_0402]
R74  49k9  [RES_0402]
R75  49k9  [RES_0402]
U15  SN74AHC02DBR  [SOP65P780X200-14N]  (parts A,B,C,D,E of 5)

### Ports
TRX (out, harness TRX), TRX_3V3 (out, harness TRX_3V3)

### Harnesses
TRX_3V3: TX_3V3, RX_3V3
TRX: TX, RX

### Nets
+3V3: C92.1 C93.1 U15.14(VDD)
DGND: C92.2 C93.2 U15.7(GND)
RX: R74.2 ; port TRX.RX
RX_3V3: U15.5(2A) U15.11(4A) U15.12(4B) ; port TRX_3V3.RX_3V3
TX: R75.2 ; port TRX.TX
TX_3V3: U15.2(1A) U15.8(3A) U15.9(3B) ; port TRX_3V3.TX_3V3
NetR74_1: R74.1 U15.1(1Y)
NetR75_1: R75.1 U15.4(2Y)
NetU15_3: U15.3(1B) U15.13(4Y)
NetU15_6: U15.6(2B) U15.10(3Y)

### Notes on the sheet
- Title
- Size
- Date:
- Sheet
- A4
- of
- Project
- Drawn By:
- Revision:

### Library data of the parts
C92 C93 = Cap: Supplier: *; Part Number: *
  C92: Value: 100n
  C93: Value: 10n
R74 R75 = Res: Part Number: *; Supplier: *; Value: 49k9
U15 = SNx4AHC02: Quadruple 2-Input Positive-Nor Gates; Supplier 1: Mouser; Supplier Part Number 1: 595-SN74AHC02DBR

## Nets that join several sheets
+1V8: ADC2 (8 pins), ADC1 (8 pins), Power_BE (C82.1 U13.1 U13.2 U13.3)
+3V3: DAC (6 pins), Interposer (C18.1 P1.B1 P1.B6 U1.5), Power_BE (6 pins), Status (R71.2), TRX_Protection (C92.1 C93.1 U15.14)
+3V3_FMC: Connectors (5 pins), Power_BE (R65.2), Status (R69.2)
+5V: DAC (8 pins), ADC2 (11 pins), ADC1 (11 pins), Power_BE (20 pins), Status (R70.2)
+12V_FMC: Connectors (J1.C35 J1.C37), Power_BE (C69.1 C70.1 U10.4 U10.8), Status (R68.2)
+50V: Interposer (P1.C1 P1.C6 P1.D1 P1.D6), Power_BE (D1.2 J4.2), Status (R72.2 R73.2)
-5V: DAC (C7.1 C8.1 U2.4), Power_BE (C68.1 U9.5)
AGND: DAC (17 pins), Interposer (J3.2 R41.1), ADC2 (8 pins), ADC1 (8 pins), Power_BE (36 pins), Status (LED5.1 LED6.2)
DGND: Connectors (62 pins), DAC (20 pins), ADC2 (7 pins), ADC1 (7 pins), Power_BE (5 pins), Status (6 pins), TRX_Protection (C92.2 C93.2 U15.7)
ADC1_CLK_N: Connectors (J1.G13), ADC1 (R59_ADC1.2 U8_ADC1.16)
ADC1_CLK_P: Connectors (J1.G12), ADC1 (R59_ADC1.1 U8_ADC1.17)
ADC2_CLK_N: Connectors (J1.G7), ADC2 (R59_ADC2.2 U8_ADC2.16)
ADC2_CLK_P: Connectors (J1.G6), ADC2 (R59_ADC2.1 U8_ADC2.17)
ADC_IN_N: Interposer (P1.F4), ADC1 (U8_ADC1.22)
ADC_IN_N: Interposer (P1.F6), ADC2 (U8_ADC2.22)
ADC_IN_P: Interposer (P1.F3), ADC1 (U8_ADC1.23)
ADC_IN_P: Interposer (P1.F5), ADC2 (U8_ADC2.23)
CNV1_N: Connectors (J1.D15), ADC1 (R60_ADC1.2 U8_ADC1.8)
CNV1_P: Connectors (J1.D14), ADC1 (R60_ADC1.1 U8_ADC1.9)
CNV2_N: Connectors (J1.D9), ADC2 (R60_ADC2.2 U8_ADC2.8)
CNV2_P: Connectors (J1.D8), ADC2 (R60_ADC2.1 U8_ADC2.9)
DCO1_N: Connectors (J1.H14), ADC1 (U8_ADC1.14)
DCO1_P: Connectors (J1.H13), ADC1 (U8_ADC1.15)
DCO2_N: Connectors (J1.H5), ADC2 (U8_ADC2.14)
DCO2_P: Connectors (J1.H4), ADC2 (U8_ADC2.15)
DOUT1_N: Connectors (J1.H17), ADC1 (U8_ADC1.10)
DOUT1_P: Connectors (J1.H16), ADC1 (U8_ADC1.11)
DOUT2_N: Connectors (J1.H8), ADC2 (U8_ADC2.10)
DOUT2_P: Connectors (J1.H7), ADC2 (U8_ADC2.11)
EN0: Connectors (J1.G9), ADC2 (U8_ADC2.4), ADC1 (U8_ADC1.4)
EN1: Connectors (J1.G10), ADC2 (U8_ADC2.5), ADC1 (U8_ADC1.5)
EN2: Connectors (J1.H10), ADC2 (U8_ADC2.6), ADC1 (U8_ADC1.6)
EN3: Connectors (J1.H11), ADC2 (U8_ADC2.7), ADC1 (U8_ADC1.7)
NetR2_2: DAC (R2.2 U2.6), Interposer (R40.1)
RX: Interposer (P1.F1), TRX_Protection (R74.2)
TX: Interposer (P1.E1), TRX_Protection (R75.2)